# Altium schematic sheet Power.SchDoc
size A4
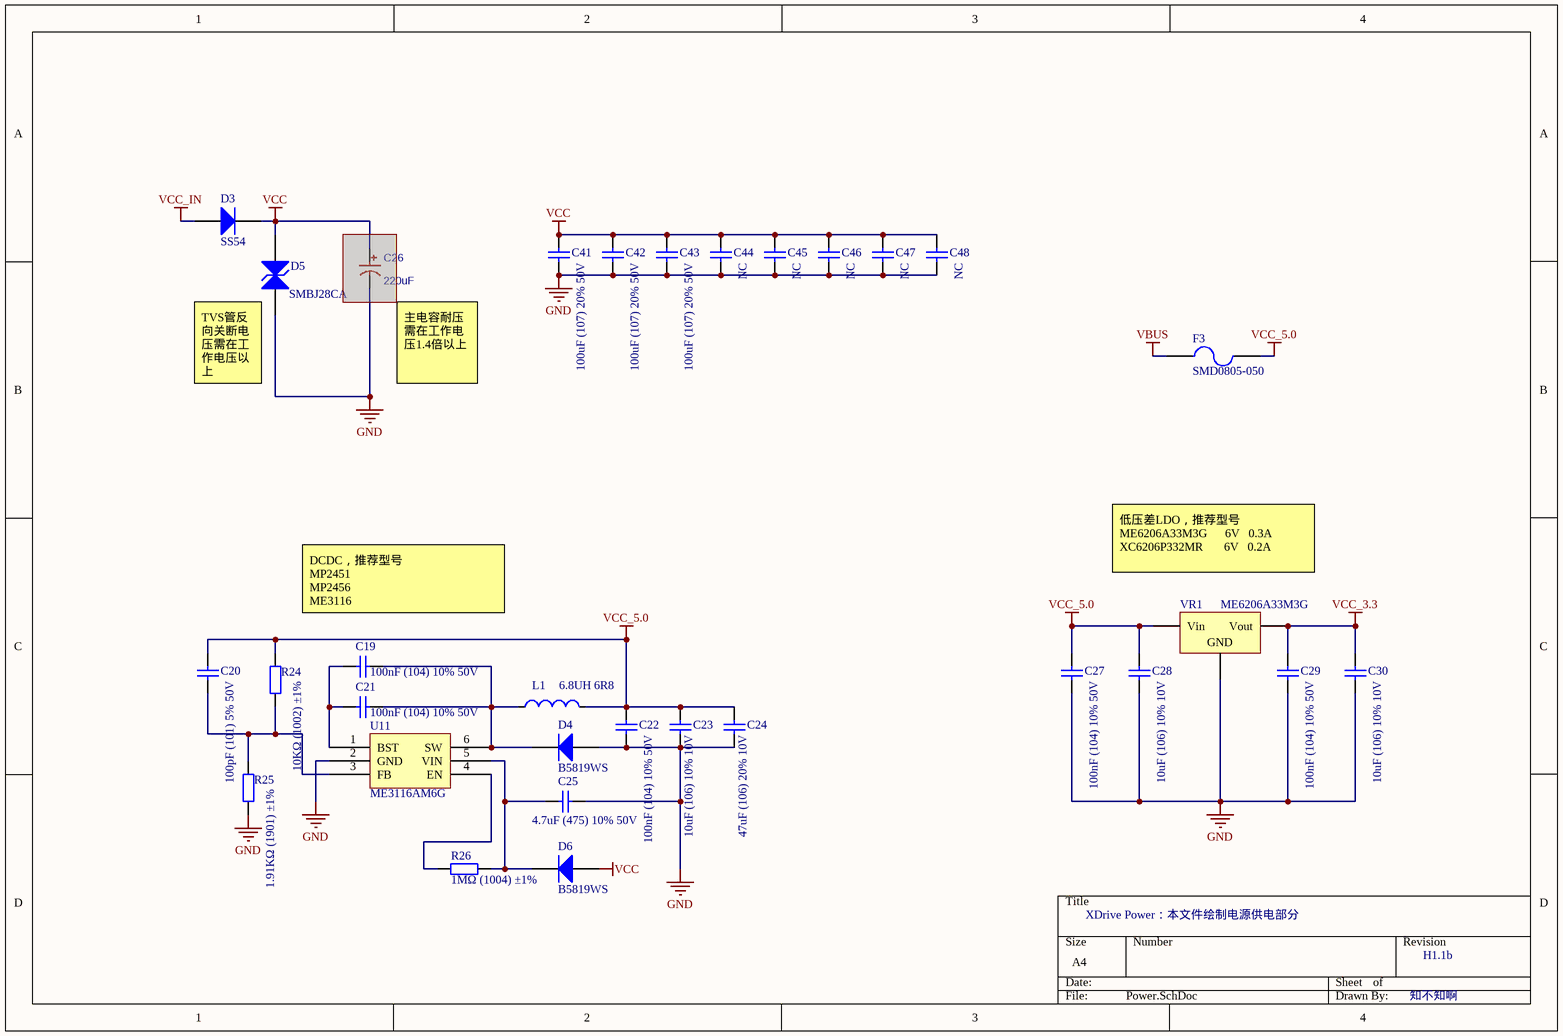
[diagram p0: Power.SchDoc]

## Parts
C19  100nF (104) 10% 50V  [0603_C]
C20  100pF (101) 5% 50V  [0603_C]
C21  100nF (104) 10% 50V  [0603_C]
C22  100nF (104) 10% 50V  [0603_C]
C23  10uF (106) 10% 10V  [0603_C]
C24  47uF (106) 20% 10V  [1206_C]
C25  4.7uF (475) 10% 50V  [1206_C]
C26  220uF  [CAP 3.5*8*11.5 - GD]  (masked out: inside a compile mask, not in the netlist)
C27  100nF (104) 10% 50V  [0603_C]
C28  10uF (106) 10% 10V  [0603_C]
C29  100nF (104) 10% 50V  [0603_C]
C30  10uF (106) 10% 10V  [0603_C]
C41  100uF (107) 20% 50V  [C 1210_L]
C42  100uF (107) 20% 50V  [C 1210_L]
C43  100uF (107) 20% 50V  [C 1210_L]
C44  NC  [C 1210_L]
C45  NC  [C 1210_L]
C46  NC  [C 1210_L]
C47  NC  [C 1210_L]
C48  NC  [C 1210_L]
D3  SS54  [SMB]
D4  B5819WS  [SOD-323]
D5  SMBJ28CA  [SMB]
D6  B5819WS  [SOD-323]
F3  SMD0805-050  [FU 0805]
L1  6.8UH 6R8  [L 1206]
R24  10KΩ (1002) ±1%  [0603_R]
R25  1.91KΩ (1901) ±1%  [0603_R]
R26  1MΩ (1004) ±1%  [0603_R]
U11  ME3116AM6G  [SOT-23-6]
VR1  ME6206A33M3G  [SOT-23-3L]

## Nets
GND: C22.1 C23.1 C24.1 C25.2 C27.1 C28.1 C29.1 C30.1 C41.1 C42.1 C43.1 C44.1 C45.1 C46.1 C47.1 C48.1 D4.1(A) D5.1(A) R25.1 U11.2(GND) VR1.1(GND)
VBUS: F3.1
VCC: C41.2 C42.2 C43.2 C44.2 C45.2 C46.2 C47.2 C48.2 D3.2(K) D5.2(K) D6.1(A)
VCC_3.3: C29.2 C30.2 VR1.2(Vout)
VCC_5.0: C20.1 C22.2 C23.2 C24.2 C27.2 C28.2 F3.2 L1.2 R24.2 VR1.3(Vin)
VCC_IN: D3.1(A)
NetC19_1: C19.1 C21.1 U11.1(BST)
NetC19_2: C19.2 C21.2 D4.2(K) L1.1 U11.6(SW)
NetC20_2: C20.2 R24.1 R25.2 U11.3(FB)
NetC25_1: C25.1 D6.2(K) R26.1 U11.5(VIN)
NetR26_2: R26.2 U11.4(EN)

## Notes on the sheet
- (near D5) TVS管反向关断电压需在工作电压以上
- (near C26) 主电容耐压需在工作电压1.4倍以上
- 低压差LDO，推荐型号
  ME6206A33M3G      6V   0.3A
  XC6206P332MR       6V   0.2A
- DCDC，推荐型号
  MP2451
  MP2456
  ME3116
- XDrive Power：本文件绘制电源供电部分
- H1.1b
- 知不知啊

## Library data of the parts
C19 C21 C22 C27 C29 = 0603 100nF (104) 10% 50V: 贴片电容; ComponentLink1Description: 供应商链接; ComponentLink1URL: http://www.szlcsc.com/product/details_15331.html; Package: 0603; Supplier: LC; SuppliersPartNumber: C14663
C20 = 0603 100pF (101) 5% 50V: 贴片电容; ComponentLink1Description: 供应商链接; ComponentLink1URL: http://www.szlcsc.com/product/details_15530.html; Package: 0603; Supplier: LC; SuppliersPartNumber: C14858
C23 C28 C30 = 0603 10uF (106) 10% 10V: 贴片电容; ComponentLink1Description: 供应商链接; ComponentLink1URL: http://www.szlcsc.com/product/details_20411.html; Package: 0603; Supplier: LC; SuppliersPartNumber: C19702
C24 = 1206 10uF (106) 10% 50V: 贴片电容; ComponentLink1Description: 供应商链接; ComponentLink1URL: http://www.szlcsc.com/product/details_14236.html; Package: 1206; Supplier: LC; SuppliersPartNumber: C13585
C25 = 1206 4.7uF (475) 10% 50V: 贴片电容; ComponentLink1Description: 供应商链接; ComponentLink1URL: http://www.szlcsc.com/product/details_30577.html; Package: 1206; Supplier: LC; SuppliersPartNumber: C29823
C26 = CAP_SMD,8x10.2mm: 直插电解电容; BOM_Manufacturer: ROQANG; BOM_Manufacturer Part: RVT1A471M0810; nameAlias: Capacitance; BOM_Supplier: LCSC; BOM_Supplier Part: C72516; spicePre: C; spiceSymbolName: RVT1A471M0810
C41-C48 = Cap: 贴片电容; Published: 8-Jun-2000; LatestRevisionDate: 17-Jul-2002; LatestRevisionNote: Re-released for DXP Platform.; PackageReference: RAD-0.3; Publisher: Altium Limited; PackageDescription: Radial Cap, Thru-Hole; 2 Leads; 0.3 in Pin Spacing
D3 = SMA(DO-214AC) SS54: 二极管; ComponentLink1Description: 供应商链接; ComponentLink1URL: http://www.szlcsc.com/product/details_23178.html; Package: SMA(DO-214AC); Supplier: LC; SuppliersPartNumber: C22452
D4 D6 = SOD-323 1N4148WS T4: 二极管; ComponentLink1Description: 供应商链接; ComponentLink1URL: http://www.szlcsc.com/product/details_2485.html; Package: SOD-323; Supplier: LC; SuppliersPartNumber: C2128
D5 = SMB/DO-214AA P6SMB6.8CA: TVS; ComponentLink1Description: 供应商链接; ComponentLink1URL: http://www.szlcsc.com/product/details_79530.html; Package: SMB/DO-214AA; Supplier: LC; SuppliersPartNumber: C78395
F3 = Fuse 2: 自恢复保险丝 500mA; Published: 8-Jun-2000; LatestRevisionDate: 17-Jul-2002; LatestRevisionNote: Re-released for DXP Platform.; PackageReference: PIN-W2/E2.8; Publisher: Altium Limited; PackageDescription: Thru-Hole; 2 Leads
L1 = IND: 贴片电感
R24 = 0603 10KΩ (1002) 1%: 贴片电阻; ComponentLink1Description: 供应商链接; ComponentLink1URL: http://www.szlcsc.com/product/details_26547.html; Package: 0603; Supplier: LC; SuppliersPartNumber: C25804
R25 = 0603 1KΩ (1001) 1%: 贴片电阻; ComponentLink1Description: 供应商链接; ComponentLink1URL: http://www.szlcsc.com/product/details_21904.html; Package: 0603; Supplier: LC; SuppliersPartNumber: C21190
R26 = 0603 1MΩ (1004) 1%: 贴片电阻; ComponentLink1Description: 供应商链接; ComponentLink1URL: http://www.szlcsc.com/product/details_23662.html; Package: 0603; Supplier: LC; SuppliersPartNumber: C22935
U11 = MP2451DT-LF-Z_[C14123]: DC-DC芯片; ComponentLink1Description: 供应商链接; ComponentLink1URL: http://www.szlcsc.com/product/details_14780.html; Package: SOT-23-6; Supplier: LC; SuppliersPartNumber: C14123
VR1 = SOT-23 XC6206P332MR: 低压差线性稳压(LDO); ComponentLink1Description: 供应商链接; ComponentLink1URL: http://www.szlcsc.com/product/details_5896.html; Package: SOT-23; Supplier: LC; SuppliersPartNumber: C5446